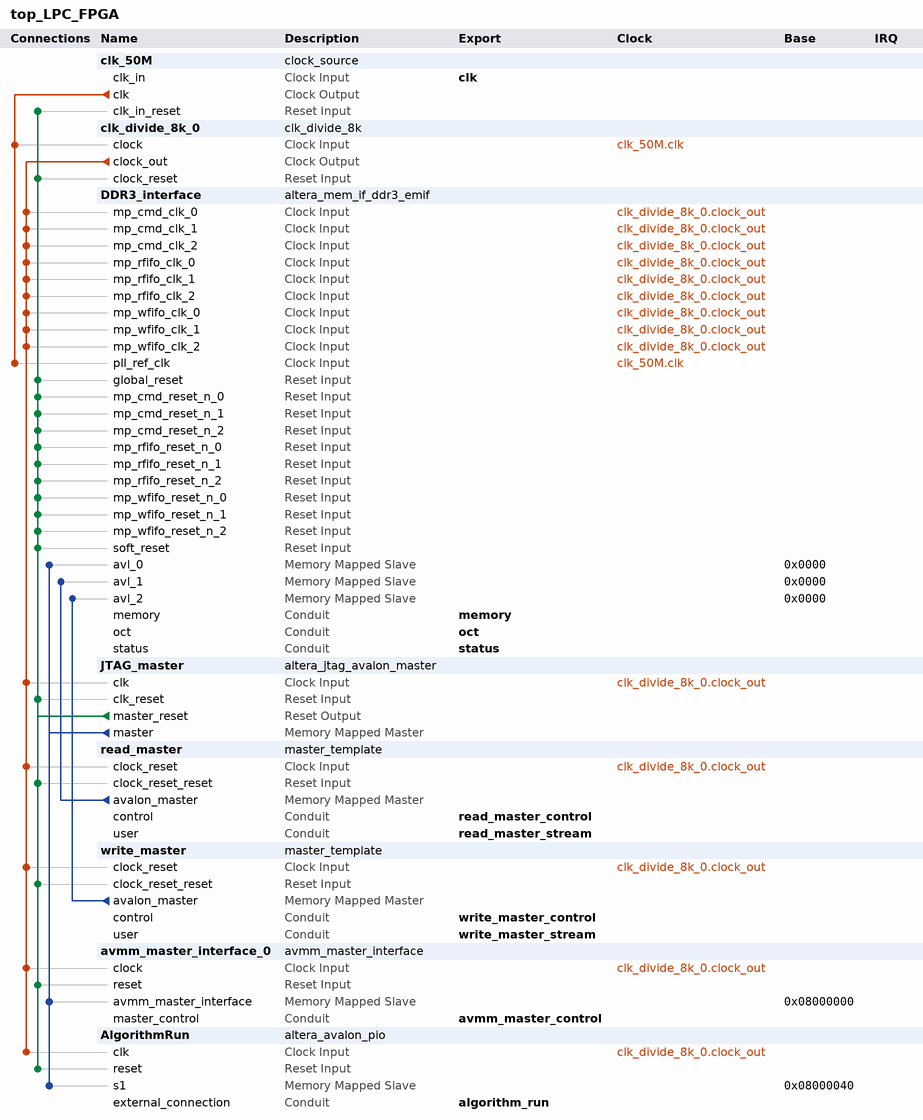
[diagram p0: system contents]
# Platform Designer (Qsys) system top_LPC_FPGA, Cyclone V 5CEFA2F23C8
# Parameters at their usual value, and those the tool derives, are not listed.
package require -exact qsys 15.0
create_system top_LPC_FPGA
set_project_property DEVICE_FAMILY {Cyclone V}
set_project_property DEVICE 5CEFA2F23C8

add_instance clk_50M clock_source 15.0
set_instance_parameter_value clk_50M clockFrequency 50000000

add_instance clk_divide_8k_0 clk_divide_8k 1.0

add_instance DDR3_interface altera_mem_if_ddr3_emif 15.0
set_instance_parameter_value DDR3_interface AVL_MAX_SIZE 4
set_instance_parameter_value DDR3_interface CALIBRATION_MODE Skip
set_instance_parameter_value DDR3_interface CPORT_TYPE_PORT Bidirectional,Bidirectional,Bidirectional,Bidirectional,Bidirectional,Bidirectional
set_instance_parameter_value DDR3_interface EXPORT_AFI_HALF_CLK false
set_instance_parameter_value DDR3_interface HARD_EMIF true
set_instance_parameter_value DDR3_interface MEM_BANKADDR_WIDTH 3
set_instance_parameter_value DDR3_interface MEM_CLK_FREQ 300.0
set_instance_parameter_value DDR3_interface MEM_CLK_FREQ_MAX 666.667
set_instance_parameter_value DDR3_interface MEM_COL_ADDR_WIDTH 10
set_instance_parameter_value DDR3_interface MEM_DQ_WIDTH 16
set_instance_parameter_value DDR3_interface MEM_DRV_STR RZQ/6
set_instance_parameter_value DDR3_interface MEM_FORMAT DISCRETE
set_instance_parameter_value DDR3_interface MEM_ROW_ADDR_WIDTH 13
set_instance_parameter_value DDR3_interface MEM_RTT_NOM {ODT Disabled}
set_instance_parameter_value DDR3_interface MEM_RTT_WR {Dynamic ODT off}
set_instance_parameter_value DDR3_interface MEM_TCL 7
set_instance_parameter_value DDR3_interface MEM_TFAW_NS 45.0
set_instance_parameter_value DDR3_interface MEM_TRAS_NS 36.0
set_instance_parameter_value DDR3_interface MEM_TRCD_NS 13.5
set_instance_parameter_value DDR3_interface MEM_TRFC_NS 110.0
set_instance_parameter_value DDR3_interface MEM_TRP_NS 13.5
set_instance_parameter_value DDR3_interface MEM_TRRD_NS 7.5
set_instance_parameter_value DDR3_interface MEM_TRTP_NS 7.5
set_instance_parameter_value DDR3_interface MEM_TWTR 5
set_instance_parameter_value DDR3_interface MEM_VENDOR Micron
set_instance_parameter_value DDR3_interface MEM_WTCL 6
set_instance_parameter_value DDR3_interface NUM_OF_PORTS 3
set_instance_parameter_value DDR3_interface PLL_LOCATION Top_Bottom
set_instance_parameter_value DDR3_interface POWER_OF_TWO_BUS false
set_instance_parameter_value DDR3_interface PRIORITY_PORT 1,1,1,1,1,1
set_instance_parameter_value DDR3_interface RATE Full
set_instance_parameter_value DDR3_interface REF_CLK_FREQ 125.0
set_instance_parameter_value DDR3_interface SPEED_GRADE 8
set_instance_parameter_value DDR3_interface TIMING_BOARD_AC_SKEW 0.02
set_instance_parameter_value DDR3_interface TIMING_BOARD_AC_TO_CK_SKEW 0.0
set_instance_parameter_value DDR3_interface TIMING_BOARD_DQ_TO_DQS_SKEW 0.0
set_instance_parameter_value DDR3_interface TIMING_BOARD_MAX_CK_DELAY 0.6
set_instance_parameter_value DDR3_interface TIMING_BOARD_MAX_DQS_DELAY 0.6
set_instance_parameter_value DDR3_interface TIMING_BOARD_SKEW_BETWEEN_DQS 0.02
set_instance_parameter_value DDR3_interface TIMING_BOARD_SKEW_CKDQS_DIMM_MAX 0.01
set_instance_parameter_value DDR3_interface TIMING_BOARD_SKEW_CKDQS_DIMM_MIN -0.01
set_instance_parameter_value DDR3_interface TIMING_BOARD_SKEW_WITHIN_DQS 0.02
set_instance_parameter_value DDR3_interface TIMING_TDH 65
set_instance_parameter_value DDR3_interface TIMING_TDQSCK 255
set_instance_parameter_value DDR3_interface TIMING_TDQSQ 125
set_instance_parameter_value DDR3_interface TIMING_TDQSS 0.25
set_instance_parameter_value DDR3_interface TIMING_TDS 30
set_instance_parameter_value DDR3_interface TIMING_TDSH 0.2
set_instance_parameter_value DDR3_interface TIMING_TDSS 0.2
set_instance_parameter_value DDR3_interface TIMING_TIH 140
set_instance_parameter_value DDR3_interface TIMING_TIS 190
set_instance_parameter_value DDR3_interface TIMING_TQSH 0.4
set_instance_parameter_value DDR3_interface USER_DEBUG_LEVEL 1

add_instance JTAG_master altera_jtag_avalon_master 15.0

add_instance read_master master_template 1.0
set_instance_parameter_value read_master ADDRESS_WIDTH 32
set_instance_parameter_value read_master BURST_CAPABLE 1
set_instance_parameter_value read_master DATA_WIDTH 16
set_instance_parameter_value read_master FIFO_DEPTH 32
set_instance_parameter_value read_master MASTER_DIRECTION 0
set_instance_parameter_value read_master MAXIMUM_BURST_COUNT 4
set_instance_parameter_value read_master MEMORY_BASED_FIFO 1

add_instance write_master master_template 1.0
set_instance_parameter_value write_master ADDRESS_WIDTH 32
set_instance_parameter_value write_master BURST_CAPABLE 1
set_instance_parameter_value write_master DATA_WIDTH 16
set_instance_parameter_value write_master FIFO_DEPTH 32
set_instance_parameter_value write_master MASTER_DIRECTION 1
set_instance_parameter_value write_master MAXIMUM_BURST_COUNT 4
set_instance_parameter_value write_master MEMORY_BASED_FIFO 1

add_instance avmm_master_interface_0 avmm_master_interface 1.0

add_instance AlgorithmRun altera_avalon_pio 15.0
set_instance_parameter_value AlgorithmRun direction Output
set_instance_parameter_value AlgorithmRun width 1

# connections
add_connection clk_50M.clk clk_divide_8k_0.clock clock
add_connection clk_50M.clk DDR3_interface.pll_ref_clk clock
add_connection clk_divide_8k_0.clock_out AlgorithmRun.clk clock
add_connection clk_divide_8k_0.clock_out avmm_master_interface_0.clock clock
add_connection clk_divide_8k_0.clock_out DDR3_interface.mp_cmd_clk_0 clock
add_connection clk_divide_8k_0.clock_out DDR3_interface.mp_cmd_clk_1 clock
add_connection clk_divide_8k_0.clock_out DDR3_interface.mp_cmd_clk_2 clock
add_connection clk_divide_8k_0.clock_out DDR3_interface.mp_rfifo_clk_0 clock
add_connection clk_divide_8k_0.clock_out DDR3_interface.mp_rfifo_clk_1 clock
add_connection clk_divide_8k_0.clock_out DDR3_interface.mp_rfifo_clk_2 clock
add_connection clk_divide_8k_0.clock_out DDR3_interface.mp_wfifo_clk_0 clock
add_connection clk_divide_8k_0.clock_out DDR3_interface.mp_wfifo_clk_1 clock
add_connection clk_divide_8k_0.clock_out DDR3_interface.mp_wfifo_clk_2 clock
add_connection clk_divide_8k_0.clock_out JTAG_master.clk clock
add_connection clk_divide_8k_0.clock_out read_master.clock_reset clock
add_connection clk_divide_8k_0.clock_out write_master.clock_reset clock
add_connection JTAG_master.master_reset AlgorithmRun.reset reset
add_connection JTAG_master.master_reset avmm_master_interface_0.reset reset
add_connection JTAG_master.master_reset clk_50M.clk_in_reset reset
add_connection JTAG_master.master_reset clk_divide_8k_0.clock_reset reset
add_connection JTAG_master.master_reset DDR3_interface.global_reset reset
add_connection JTAG_master.master_reset DDR3_interface.mp_cmd_reset_n_0 reset
add_connection JTAG_master.master_reset DDR3_interface.mp_cmd_reset_n_1 reset
add_connection JTAG_master.master_reset DDR3_interface.mp_cmd_reset_n_2 reset
add_connection JTAG_master.master_reset DDR3_interface.mp_rfifo_reset_n_0 reset
add_connection JTAG_master.master_reset DDR3_interface.mp_rfifo_reset_n_1 reset
add_connection JTAG_master.master_reset DDR3_interface.mp_rfifo_reset_n_2 reset
add_connection JTAG_master.master_reset DDR3_interface.mp_wfifo_reset_n_0 reset
add_connection JTAG_master.master_reset DDR3_interface.mp_wfifo_reset_n_1 reset
add_connection JTAG_master.master_reset DDR3_interface.mp_wfifo_reset_n_2 reset
add_connection JTAG_master.master_reset DDR3_interface.soft_reset reset
add_connection JTAG_master.master_reset JTAG_master.clk_reset reset
add_connection JTAG_master.master_reset read_master.clock_reset_reset reset
add_connection JTAG_master.master_reset write_master.clock_reset_reset reset
add_connection JTAG_master.master AlgorithmRun.s1 avalon
set_connection_parameter_value JTAG_master.master/AlgorithmRun.s1 baseAddress 0x08000040
add_connection JTAG_master.master avmm_master_interface_0.avmm_master_interface avalon
set_connection_parameter_value JTAG_master.master/avmm_master_interface_0.avmm_master_interface baseAddress 0x08000000
add_connection JTAG_master.master DDR3_interface.avl_0 avalon
set_connection_parameter_value JTAG_master.master/DDR3_interface.avl_0 baseAddress 0x0000
add_connection read_master.avalon_master DDR3_interface.avl_1 avalon
set_connection_parameter_value read_master.avalon_master/DDR3_interface.avl_1 baseAddress 0x0000
add_connection write_master.avalon_master DDR3_interface.avl_2 avalon
set_connection_parameter_value write_master.avalon_master/DDR3_interface.avl_2 baseAddress 0x0000

# exported interfaces
add_interface algorithm_run conduit end
set_interface_property algorithm_run EXPORT_OF AlgorithmRun.external_connection
add_interface avmm_master_control conduit end
set_interface_property avmm_master_control EXPORT_OF avmm_master_interface_0.master_control
add_interface clk clock sink
set_interface_property clk EXPORT_OF clk_50M.clk_in
add_interface memory conduit end
set_interface_property memory EXPORT_OF DDR3_interface.memory
add_interface oct conduit end
set_interface_property oct EXPORT_OF DDR3_interface.oct
add_interface read_master_control conduit end
set_interface_property read_master_control EXPORT_OF read_master.control
add_interface read_master_stream conduit end
set_interface_property read_master_stream EXPORT_OF read_master.user
add_interface status conduit end
set_interface_property status EXPORT_OF DDR3_interface.status
add_interface write_master_control conduit end
set_interface_property write_master_control EXPORT_OF write_master.control
add_interface write_master_stream conduit end
set_interface_property write_master_stream EXPORT_OF write_master.user

set_interconnect_requirement {$system} qsys_mm.clockCrossingAdapter HANDSHAKE
set_interconnect_requirement {$system} qsys_mm.insertDefaultSlave FALSE
set_interconnect_requirement {$system} qsys_mm.maxAdditionalLatency 1

save_system top_LPC_FPGA.qsys
